# EAGLE design 5vInlinePSU (EAGLE 8.3.2)
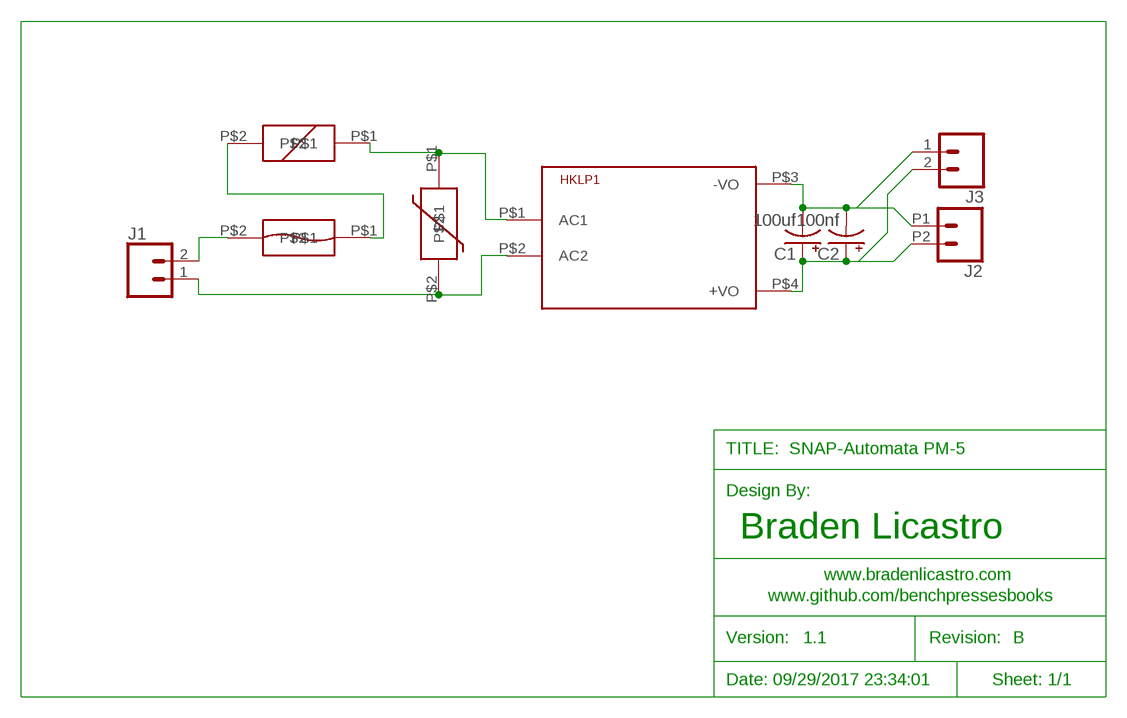
[diagram p0: schematic, sheet 1]

## Parts
C1  100uf  CPOL-USE5-8.5  [E5-8,5]
C2  100nf  CPOL-USE2.5-6  [E2,5-6]
HKLP1  HKLPM01  [HKLPM01]
J1  CONN_025MM  [SCREWTERMINAL-5MM-2]
J2  CONN_022.54MM_SCREWTERM  [1X02_2.54_SCREWTERM]
J3  CONN_02  [1X02]
SDF  GENERIC_FUSE_3.6X10MMTHROUGH-HOLE  [GENERIC_FUSE_3.6X10MM]
U$2  THERMAL_FUSE_SF70ETHROUGH-HOLE  [THERMAL_FUSE_SF70E]
U$3  VARISTOR_TVR-07241THROUGH-HOLE  [VARISTOR_TVR-07241]

## Nets
N$1: J1.2 SDF.P$2
N$2: SDF.P$1 U$2.P$2
N$3: HKLP1.P$1(AC1) U$2.P$1 U$3.P$1
N$4: HKLP1.P$2(AC2) J1.1 U$3.P$2
N$5: C1.- C2.- HKLP1.P$3(-VO) J2.P1 J3.1
N$6: C1.+ C2.+ HKLP1.P$4(+VO) J2.P2 J3.2

## Notes on the sheet
- TITLE: | SNAP-Automata PM-5
- Design By:
- Braden Licastro
- www.bradenlicastro.com
- www.github.com/benchpressesbooks
- Version: | 1.1 | Revision: | B
- Date: 09/29/2017 23:34:01 | Sheet: 1/1

## Library data of the parts
C1 C2 = rcl:CPOL-US: POLARIZED CAPACITOR, American symbol
HKLP1 = bl_components:HKLPM01: 125-250vAC to 5vDC power converter with OCP OVP OTP
J1 = SparkFun-Connectors:CONN_02: Multi connection point. Often used as Generic Header-pin footprint for 0.1 inch spaced/style header connections On any of the 0.1 inch spaced packages, you can populate with these: Break Away Headers - Straight <https://www.sparkfun.com/products/116> (PRT-00116) Break Away Male Headers - Right Angle <https://www.sparkfun.com/products/553> (PRT-00553) Female Headers <https://www.sparkfun.com/products/115> (PRT-00115) Break Away Headers - Machine Pin <https://www.sparkfun.com/products/117> (PRT-00117) Break Away Female Headers - Swiss Machine Pin <https://www.sparkfun.com/products/743> (PRT-00743) For SCREWTERMINALS and SPRING TERMINALS visit here: Screw Terimnals on SparkFun.com <https://www.sparkfun.com/search/results?term=Screw+Terminals> (5mm/3.5mm/2.54mm spacing) This device is also useful as a general connection point to wire up your design to another part of your project. Our various solder wires solder well into these plated through hole pads. Hook-Up Wire - Assortment (Stranded, 22 AWG) <https://www.sparkfun.com/products/11375> (PRT-11375) Hook-Up Wire - Assortment (Solid Core, 22 AWG) <https://www.sparkfun.com/products/11367> (PRT-11367) View the entire wire category on our website here <https://www.sparkfun.com/categories/141> Special notes: Molex polarized connector foot print use with: PRT-08233 with associated crimp pins and housings. 2.54_SCREWTERM for use with PRT-10571. 3.5mm Screw Terminal footprints for PRT-08084 5mm Screw Terminal footprints for use with PRT-08432; SF_SKU: PRT-08432
J2 J3 = SparkFun-Connectors:CONN_02: Multi connection point. Often used as Generic Header-pin footprint for 0.1 inch spaced/style header connections On any of the 0.1 inch spaced packages, you can populate with these: Break Away Headers - Straight <https://www.sparkfun.com/products/116> (PRT-00116) Break Away Male Headers - Right Angle <https://www.sparkfun.com/products/553> (PRT-00553) Female Headers <https://www.sparkfun.com/products/115> (PRT-00115) Break Away Headers - Machine Pin <https://www.sparkfun.com/products/117> (PRT-00117) Break Away Female Headers - Swiss Machine Pin <https://www.sparkfun.com/products/743> (PRT-00743) For SCREWTERMINALS and SPRING TERMINALS visit here: Screw Terimnals on SparkFun.com <https://www.sparkfun.com/search/results?term=Screw+Terminals> (5mm/3.5mm/2.54mm spacing) This device is also useful as a general connection point to wire up your design to another part of your project. Our various solder wires solder well into these plated through hole pads. Hook-Up Wire - Assortment (Stranded, 22 AWG) <https://www.sparkfun.com/products/11375> (PRT-11375) Hook-Up Wire - Assortment (Solid Core, 22 AWG) <https://www.sparkfun.com/products/11367> (PRT-11367) View the entire wire category on our website here <https://www.sparkfun.com/categories/141> Special notes: Molex polarized connector foot print use with: PRT-08233 with associated crimp pins and housings. 2.54_SCREWTERM for use with PRT-10571. 3.5mm Screw Terminal footprints for PRT-08084 5mm Screw Terminal footprints for use with PRT-08432
SDF = bl_components:GENERIC_FUSE_3.6X10MM: 3.6x10mm Generic Fuse
U$2 = bl_components:THERMAL_FUSE_SF70E: 70C Resettable Axial Lead Thermal Fuse
U$3 = bl_components:VARISTOR_TVR-07241: 150v 7mm disk varistor

## Board
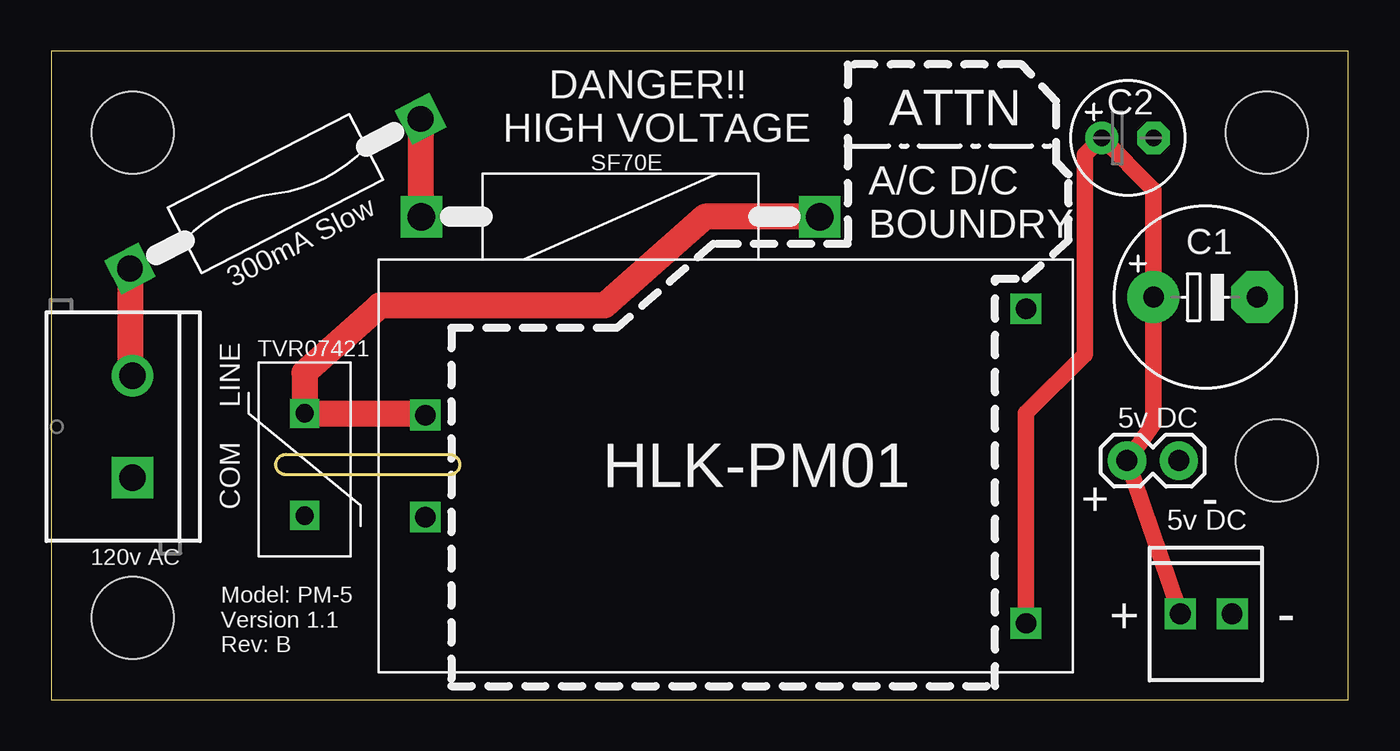
[diagram p1: board, top side]
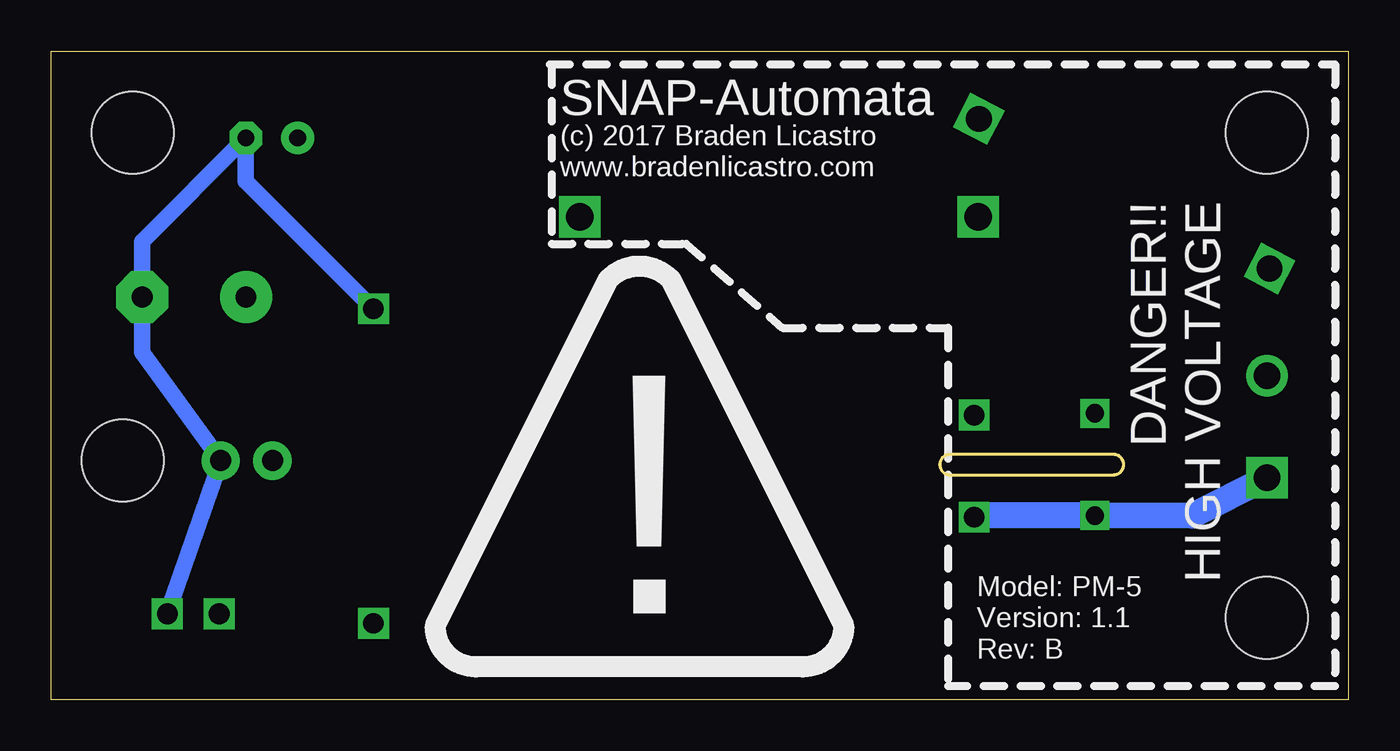
[diagram p2: board, bottom side, seen from below]

Size 63.5 x 31.75 mm. Coordinates in mm from the lower left corner, seen from the top.
Outline: 0,0 63.5,0 63.5,31.75 0,31.75 0,0
Copper layers (1*16): Top 0.035mm / dielectric 1.5mm / Bottom 0.035mm
Design rules "SeeedStudio_2layer_DRU_no_angle_20140221": minimum track width 6mil, minimum drill 12mil, track to track 6mil, track to pad 6mil, pad to pad 6mil, via to via 6mil, smd to smd 0mil, copper to edge 10mil, drill to drill 10mil, minimum pad ring 10mil, minimum via ring 6mil, stop-mask expansion 2mil, vias tented up to drill 100mil, thermal gap 10mil
Holes 4 mm at 4,27.75 59.5,27.75 4,4 60,11.7
Milling: 4 lines

### Footprints (pad centres in the part's own frame; a part is rotated, then mirrored left to right if it is on the bottom)
E5-8,5 = drill 1.016 pad 2.54: + -2.54,0 | drill 1.016 pad 2.54 octagon: - 2.54,0
E2,5-6 = drill 0.813 pad 1.6: + -1.27,0 | drill 0.813 pad 1.6 octagon: - 1.27,0
HKLPM01 = drill 1 square: P$1 -14.7,2.5; P$2 -14.7,-2.5; P$3 14.7,7.7; P$4 14.7,-7.7
SCREWTERMINAL-5MM-2 = drill 1.3 pad 2.032 square: 1 0,0 | drill 1.3 pad 2.032: 2 5,0
1X02_2.54_SCREWTERM = drill 1.016 square: P1 2.54,0; P2 0,0
1X02 = drill 1.016 pad 1.88: 1 0,0; 2 2.54,0
GENERIC_FUSE_3.6X10MM = drill 1.25 square: P$1 -2.949,1.848; P$2 13.051,1.848
THERMAL_FUSE_SF70E = drill 1.35 square: P$1 -3,2.1; P$2 16.5,2.1
VARISTOR_TVR-07241 = drill 0.9 square: P$1 2.5,2.25; P$2 7.5,2.25

### Placement (x,y rotation side)
C1  56.5,19.7 0 top
C2  52.7,27.5 0 top
HKLP1  33.02,11.43 0 top
J1  3.98,10.86 90 top
J2  55.27,4.19 0 top
J3  55.2,11.7 180 top
SDF  14.62,28.73 207.3 top
U$1  [DANGER_SYMBOL]  34.7,11.6 0 top
U$2  34.63,25.74 180 top
U$3  10.16,16.51 270 top

### Tracks (layer width: path | path; a pad name or v marks a point on that pad's centre or on a via)
N$1
  Top 1.27: SDF.P$2 3.87,16.37 J1.2
N$2
  Top 0.8: 18.09,23.68 U$2.P$2
  Top 1.27: SDF.P$1 18.09,23.68
N$3
  Top 0.8: 18.24,14.01 HKLP1.P$1 | U$3.P$1
  Top 1.27: U$3.P$1 18.24,14.01 | U$2.P$1 32,23.64 27.1,19.3 16.1,19.3 12.4,16 U$3.P$1
N$4
  Bottom 0.8: 18.24,9.01 HKLP1.P$2
  Bottom 1.27: J1.1 7.66,9 U$3.P$2 18.24,9.01
N$5
  Bottom 0.8: J2.P1 J3.1 59.04,17 C1.- 59.04,22.43 C2.- 53.97,25.38 HKLP1.P$3
N$6
  Top 0.61: J3.2
  Top 0.8: J2.P2 J3.2 53.96,13.5 C1.+ 53.96,24.97 C2.+ 50.6,26.67 50.6,16.9 47.72,14.02 HKLP1.P$4

### Text on the board
tNames: ATTN | DANGER!! / HIGH VOLTAGE | SF70E | 300mA Slow | A/C D/C / BOUNDRY | TVR07421 | LINE | 5v DC | HLK-PM01 | COM | + | - | 5v DC | 120v AC | + | - | Model: PM-5 / Version 1.1 / Rev: B
bNames: SNAP-Automata | (c) 2017 Braden Licastro / www.bradenlicastro.com | DANGER!! / HIGH VOLTAGE | Model: PM-5 / Version: 1.1 / Rev: B